# Altium schematic sheet MAX490.SchDoc
size A
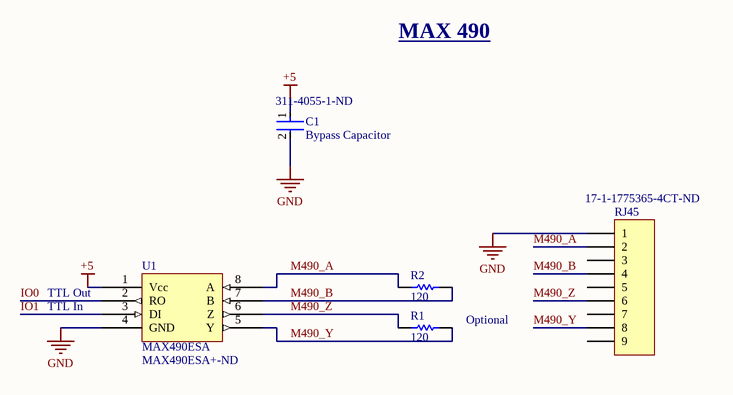
[diagram p0: MAX490.SchDoc]

## Parts
C1  Bypass Capacitor  Supplier Part Number 1: 311-4055-1-ND  [FP-CC0603-DA-MFG]
R1  Optional  value 120  [1608[0603]]
R2  value 120  [1608[0603]]
RJ45  Supplier Part Number 1: 17-1-1775365-4CT-ND  [1-1775365-4]
U1  MAX490ESA  Supplier Part Number 1: MAX490ESA+-ND  [SO-8_L]

## Nets
+5: C1.1 U1.1(Vcc)
GND: C1.2 RJ45.1 U1.4(GND)
IO0: U1.2(RO)
IO1: U1.3(DI)
M490_A: R2.2 RJ45.2 U1.8(A)
M490_B: R2.1 RJ45.4 U1.7(B)
M490_Y: R1.1 RJ45.8 U1.5(Y)
M490_Z: R1.2 RJ45.6 U1.6(Z)

Not connected (* = marked no-connect by the designer): RJ45 3 5 7 9

## Notes on the sheet
- MAX 490
- TTL In
- (near U1) TTL Out

## Library data of the parts
C1 = CMP-03422-001228-1: CAP CER 0.1UF 10V X7R 0603; Manufacturer Part Number: CC0603KRX7R6BB104; Manufacturer: YAGEO; Material: Ceramic; Tolerance: 0.1; Capacitance: 100 nF; Temperature Coefficient: 15%; Value: 100 nF; Multilayer: Yes; Tolerance  (fill in as +-): 10%; Height: 0.9mm; RoHS: TRUE; Footprint Url: http://www.yageo.com/exep/pages/download/literatures/UPY-C_GEN_24.pdf; Octopart: https://octopart.com/cc0603krx7r6bb104-yageo-9291607; Device Class L1: Passive Components; Mouser Description: 0603 0.1 uF 10 V ±10 % Tolerance X7R SMT Multilayer Ceramic Capacitor; ComponentLink2URL: http://www.yageo.com/documents/recent/UPY-GPHC_X7R_6.3V-to-50V_18.pdf; Automotive: No; Voltage: 10 V; Device Class L3: Ceramic Capacitors; Category: Cap; Temperature: -55°C to +125°C; ComponentLink2Description: Datasheet; Voltage Rating: 10 V; Device Class L2: Capacitors; Lead Free: Yes; Temperature Range High: +125°C; Temperature Range Low: -55°C; Digikey Description: CAP CER 0.1UF 10V X7R 0603; Package: CC0603-DA; Temperature Characteristic: X7R; Supplier 1: Digikey; Stock 1: 58484; Pricing 1: 1=0.1, 10=0.055, 100=0.0327, 1000=0.02132 (USD); Mounting Technology: Surface Mount; Pins: 2; Dielectric Material: Ceramic; Package Shape: Rectangular; Case/Package: 0603; Terminal Finish: Nickel; Min Operating Temperature: -55°C; Max Operating Temperature: 125°C; JESD-609 Code: e3; Capacitor Type: Ceramic; Package Style: SMTMeter; Packaging: Tape and Reel; Tolerance (fill in as +-): 10%; Rated DC Voltage (URdc): 10V; Temperature Characteristics Code: X7R; Termination: Wraparound; Length: 1.6mm; Width: 0.8mm; Reach SVHC Compliant: Yes; RoHS Compliant: Yes; ComponentLink1URL: https://datasheet.ciiva.com:443/pdfs/VipMasterIC/IC/YAGO/YAGO-S-A0003557223/YAGO-S-A0003557223-1.pdf?src-supplier=IHS+Markit; ComponentLink1Description: https://datasheet.ciiva.com:443/pdfs/VipMasterIC/IC/YAGO/YAGO-S-A0003557223/YAGO-S-A0003557223-1.pdf?src-supplier=IHS+Markit; ComponentLink3URL: https://datasheet.ciiva.com/11586/upy-gphc-x7r-6-3v-to-50v-8-11586327.pdf?src-supplier=Avnet; ComponentLink3Description: https://datasheet.ciiva.com/11586/upy-gphc-x7r-6-3v-to-50v-8-11586327.pdf?src-supplier=Avnet
R1 R2 = Res1: SMD Chip Resistor, 120 Ohm, ± 5%, 250 mW, 0603 [1608 Metric], Thick Film, Anti-Surge; Manufacturer: Panasonic; Manufacturer Part Number: ERJ-PA3J121V; Supplier 1: Digikey; Supplier Part Number 1: P120BZCT-ND; RoHS: Yes; Category: Chip SMD Resistors; Stock 1: 57610; Pricing 1: 1=0.12, 10=0.056, 50=0.0358, 100=0.0301, 500=0.02112, 1000=0.01854 (USD); ComponentLink1URL: https://industrial.panasonic.com/cdbs/www-data/pdf/RDO0000/AOA0000C331.pdf?src-supplier=Digikey; ComponentLink1Description: https://industrial.panasonic.com/cdbs/www-data/pdf/RDO0000/AOA0000C331.pdf?src-supplier=Digikey; ComponentLink2URL: https://industrial.panasonic.com/ww/system/files/data/download/catalog/id_fixed-resistors_e_1.pdf?src-supplier=Digikey; ComponentLink2Description: https://industrial.panasonic.com/ww/system/files/data/download/catalog/id_fixed-resistors_e_1.pdf?src-supplier=Digikey; ComponentLink3URL: https://datasheet.octopart.com/ERJ-PA3J121V-Panasonic-datasheet-62096642.pdf?src-supplier=Future+Electronics; ComponentLink3Description: https://datasheet.octopart.com/ERJ-PA3J121V-Panasonic-datasheet-62096642.pdf?src-supplier=Future+Electronics
RJ45 = Header 9: Telecom and Datacom Connector; Manufacturer: TE Connectivity AMP; Manufacturer Series: 1775365; Supplier 1: Digikey; Manufacturer Part Number: 1-1775365-4; RoHS: Yes; Category: Modular / Ethernet Connectors; Stock 1: 551; Pricing 1: 1=3.81, 10=3.241, 25=3.0376, 50=2.8924 (USD); Contact Finish - Mating: NOT SPECIFIED; Connector Type: TELECOM AND DATACOM CONNECTOR; Reach SVHC Compliant: Yes; RoHS Compliant: Yes; ComponentLink1URL: https://www.te.com:443/usa-en/product-1-1775365-4.html?src-supplier=IHS+Markit; ComponentLink1Description: https://www.te.com:443/usa-en/product-1-1775365-4.html?src-supplier=IHS+Markit; ComponentLink2URL: https://datasheet.octopart.com/1-1775365-4-TE-Connectivity-datasheet-175421283.pdf?src-supplier=Farnell; ComponentLink2Description: https://datasheet.octopart.com/1-1775365-4-TE-Connectivity-datasheet-175421283.pdf?src-supplier=Farnell; ComponentLink3URL: https://www.te.com/commerce/DocumentDelivery/DDEController?Action=srchrtrv&amp;DocNm=1775365&amp;DocType=Customer+Drawing&amp;DocLang=English&src-supplier=Digikey; ComponentLink3Description: https://www.te.com/commerce/DocumentDelivery/DDEController?Action=srchrtrv&amp;DocNm=1775365&amp;DocType=Customer+Drawing&amp;DocLang=English&src-supplier=Digikey; ComponentLink4URL: http://www.te.com/commerce/DocumentDelivery/DDEController?Action=srchrtrv&DocNm=1775365&DocType=Customer+Drawing&DocLang=English&src-supplier=Digikey; ComponentLink4Description: http://www.te.com/commerce/DocumentDelivery/DDEController?Action=srchrtrv&DocNm=1775365&DocType=Customer+Drawing&DocLang=English&src-supplier=Digikey; ComponentLink5URL: https://datasheet.octopart.com/1-1775365-4-TE-Connectivity-datasheet-175421283.pdf?src-supplier=Element14; ComponentLink5Description: https://datasheet.octopart.com/1-1775365-4-TE-Connectivity-datasheet-175421283.pdf?src-supplier=Element14
U1 = MAX490ESA: Line Transceiver, 1 Func, 1 Driver, 1 Rcvr, CMOS, PDSO8; Manufacturer: Maxim; Manufacturer Part Number: MAX490ESA+; Package Body Material: Plastic; Output Polarity: Complementary; Differential Output: Yes; Driver Number of Bits: 1; High Level Input Current-Max: 2uA; Input Characteristics: DIFFERENTIAL SCHMITT TRIGGER; Out Swing-Min: 1.5V; Output Characteristics: TOTEM-POLE; Output Low Current-Max: 4mA; Package Equivalence Code: SOP8,.25; Power Supplies: 5V; Receive Delay-Max: 150ns; Max Supply Current: 500uA; Max Supply Voltage: 5.25V; Min Supply Voltage: 4.75V; Transmit Delay-Max: 60ns; Qualification Status: Not Qualified; Supplier 1: Digikey; RoHS: Yes; Category: RS-232 / RS-422 / RS-485 Interface ICs; Stock 1: 736; Pricing 1: 1=6.18, 10=4.743, 25=4.3836, 100=3.9887, 300=3.76847, 500=3.68704, 1000=3.59368, 2500=3.4951 (USD); Case/Package: SOP; Pins: 8; Package Shape: Rectangular; Terminal Finish: Tin; Min Operating Temperature: -40°C; Max Operating Temperature: 85°C; JESD-609 Code: e3; Interface IC Type: LINE TRANSCEIVER; JESD-30 Code: R-PDSO-G8; Moisture Sensitivity Level: 1; Channels: 1; Package Style: SMALL OUTLINEMeter; Peak Reflow Temperature (Cel): 260°C; Receiver Number of Bits: 1; Nominal Supply Voltage: 5V; Surface Mount: Yes; Technology: CMOS; Terminal Form: Gull Wing; Terminal Position: DUAL; Length: 4.9mm; Width: 3.9mm; Height - Seated (Max): 1.75mm; Terminal Pitch: 1.27mm; Temperature Grade: INDUSTRIAL; Reach SVHC Compliant: Yes; RoHS Compliant: Yes; ComponentLink1URL: https://datasheet.ciiva.com:443/pdfs/VipMasterIC/IC/MAXM/MAXMS13366/MAXMS13366-1.pdf?src-supplier=IHS+Markit; ComponentLink1Description: https://datasheet.ciiva.com:443/pdfs/VipMasterIC/IC/MAXM/MAXMS13366/MAXMS13366-1.pdf?src-supplier=IHS+Markit; ComponentLink2URL: https://datasheet.ciiva.com/4786/max1487-max491-96074-4786046.pdf?src-supplier=Mouser; ComponentLink2Description: https://datasheet.ciiva.com/4786/max1487-max491-96074-4786046.pdf?src-supplier=Mouser; ComponentLink3URL: https://datasheet.ciiva.com/1713/max1487-max491-1713335.pdf?src-supplier=Digikey; ComponentLink3Description: https://datasheet.ciiva.com/1713/max1487-max491-1713335.pdf?src-supplier=Digikey; ComponentLink4URL: https://datasheet.ciiva.com/3028/max1487-max491-3028673.pdf?src-supplier=Avnet; ComponentLink4Description: https://datasheet.ciiva.com/3028/max1487-max491-3028673.pdf?src-supplier=Avnet